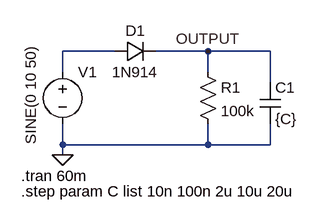
[diagram p0: schematic HalfWaveRectifier.asc]
HalfWaveRectifier.asc, the LTspice schematic file:
Version 4
SHEET 1 1256 680
WIRE 64 96 -16 96
WIRE 208 96 128 96
WIRE 304 96 208 96
WIRE -16 128 -16 96
WIRE 208 128 208 96
WIRE 304 144 304 96
WIRE -16 240 -16 208
WIRE 208 240 208 208
WIRE 208 240 -16 240
WIRE 304 240 304 208
WIRE 304 240 208 240
WIRE -16 256 -16 240
FLAG -16 256 0
FLAG 208 96 OUTPUT
SYMBOL voltage -16 112 R0
WINDOW 3 -49 -25 VRight 2
WINDOW 123 0 0 Left 0
WINDOW 39 0 0 Left 0
SYMATTR Value SINE(0 10 50)
SYMATTR InstName V1
SYMBOL diode 64 112 R270
WINDOW 0 32 32 VTop 2
WINDOW 3 0 32 VBottom 2
SYMATTR InstName D1
SYMATTR Value 1N914
SYMBOL res 192 112 R0
SYMATTR InstName R1
SYMATTR Value 100k
SYMBOL cap 288 144 R0
SYMATTR InstName C1
SYMATTR Value {C}
TEXT -80 288 Left 2 !.tran 60m
TEXT -80 312 Left 2 !.step param C list 10n 100n 2u 10u 20u

The netlist it stands for:
* HalfWaveRectifier.asc
V1 N001 0 SINE(0 10 50)
D1 N001 OUTPUT 1N914
R1 OUTPUT 0 100k
C1 OUTPUT 0 {C}
.model D D
.lib standard.dio
.tran 60m
.step param C list 10n 100n 2u 10u 20u
.backanno
.end